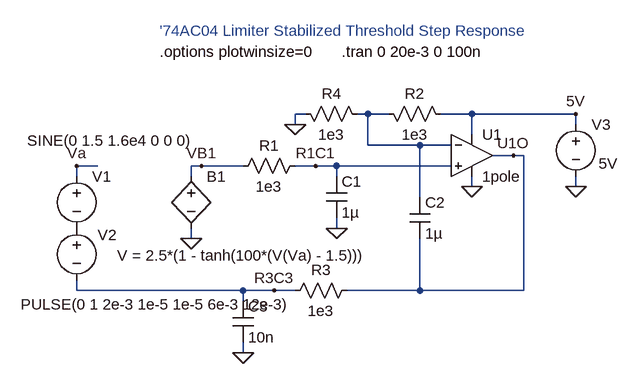
[diagram p0: schematic aclim05.asc]
aclim05.asc, the LTspice schematic file:
Version 4
SHEET 1 1260 864
WIRE -48 64 -64 64
WIRE 48 64 32 64
WIRE 80 64 48 64
WIRE 208 64 160 64
WIRE 368 64 208 64
WIRE -64 80 -64 64
WIRE 368 80 368 64
WIRE 208 96 208 64
WIRE 48 112 48 64
WIRE 128 112 48 112
WIRE 176 112 128 112
WIRE 272 128 240 128
WIRE 288 128 272 128
WIRE -368 144 -400 144
WIRE -208 144 -224 144
WIRE -144 144 -208 144
WIRE -32 144 -64 144
WIRE 0 144 -32 144
WIRE 176 144 0 144
WIRE -400 160 -400 144
WIRE -224 160 -224 144
WIRE 0 160 0 144
WIRE 208 176 208 160
WIRE 368 176 368 160
WIRE 128 192 128 112
WIRE 0 240 0 224
WIRE -224 256 -224 240
WIRE -400 336 -400 320
WIRE -144 336 -400 336
WIRE -96 336 -144 336
WIRE -64 336 -96 336
WIRE 128 336 128 256
WIRE 128 336 16 336
WIRE 288 336 288 128
WIRE 288 336 128 336
WIRE -144 352 -144 336
WIRE -144 432 -144 416
FLAG -400 144 Va
FLAG -224 256 0
FLAG -208 144 VB1
FLAG 0 240 0
FLAG -32 144 R1C1
FLAG 272 128 U1O
FLAG -144 432 0
FLAG -96 336 R3C3
FLAG 368 176 0
FLAG 368 64 5V
FLAG -64 80 0
FLAG 208 176 0
SYMBOL Voltage -400 144 R0
WINDOW 123 0 0 Left 0
WINDOW 39 0 0 Left 0
WINDOW 3 -76 -39 Left 0
SYMATTR Value SINE(0 1.5 1.6e4 0 0 0)
SYMATTR InstName V1
SYMBOL bv -224 144 R0
WINDOW 3 -114 138 Left 0
SYMATTR Value V = 2.5*(1 - tanh(100*(V(Va) - 1.5)))
SYMATTR InstName B1
SYMBOL Voltage -400 224 R0
WINDOW 123 0 0 Left 0
WINDOW 39 0 0 Left 0
WINDOW 3 -86 133 Left 0
WINDOW 0 32 26 Left 0
SYMATTR Value PULSE(0 1 2e-3 1e-5 1e-5 6e-3 12e-3)
SYMATTR InstName V2
SYMBOL cap -16 160 R0
SYMATTR InstName C1
SYMATTR Value 1µ
SYMBOL res -160 160 R270
WINDOW 0 32 56 VTop 0
WINDOW 3 0 56 VBottom 0
SYMATTR InstName R1
SYMATTR Value 1e3
SYMBOL Opamps\\1pole 208 128 R0
SYMATTR InstName U1
SYMBOL res 64 48 M90
WINDOW 0 0 56 VBottom 0
WINDOW 3 32 56 VTop 0
SYMATTR InstName R2
SYMATTR Value 1e3
SYMBOL cap 112 192 R0
SYMATTR InstName C2
SYMATTR Value 1µ
SYMBOL res -80 352 R270
WINDOW 0 32 56 VTop 0
WINDOW 3 0 56 VBottom 0
SYMATTR InstName R3
SYMATTR Value 1e3
SYMBOL cap -160 352 R0
SYMATTR InstName C3
SYMATTR Value 10n
SYMBOL res -64 48 M90
WINDOW 0 0 56 VBottom 0
WINDOW 3 32 56 VTop 0
SYMATTR InstName R4
SYMATTR Value 1e3
SYMBOL Voltage 368 64 R0
WINDOW 123 34 79 Left 0
WINDOW 39 0 0 Left 0
WINDOW 3 35 76 Left 0
SYMATTR Value 5V
SYMATTR InstName V3
TEXT -272 -64 Left 0 ;'74AC04 Limiter Stabilized Threshold Step Response
TEXT 8 -32 Left 0 !.tran 0 20e-3 0 100n
TEXT -272 -32 Left 0 !.options plotwinsize=0

The netlist it stands for:
* aclim05.asc
V1 Va P001 SINE(0 1.5 1.6e4 0 0 0)
B1 VB1 0 V = 2.5*(1 - tanh(100*(V(Va) - 1.5)))
V2 P001 R3C3 PULSE(0 1 2e-3 1e-5 1e-5 6e-3 12e-3)
C1 R1C1 0 1µ
R1 VB1 R1C1 1e3
* U1: 1pole (symbol Opamps\1pole not available, pins judged from their places): In+=R1C1 In-=N001 V+=5V V-=0 OUT=U1O
R2 N001 5V 1e3
C2 N001 U1O 1µ
R3 R3C3 U1O 1e3
C3 R3C3 0 10n
R4 0 N001 1e3
V3 5V 0 5V
* '74AC04 Limiter Stabilized Threshold Step Response
.tran 0 20e-3 0 100n
.options plotwinsize=0
.backanno
.end